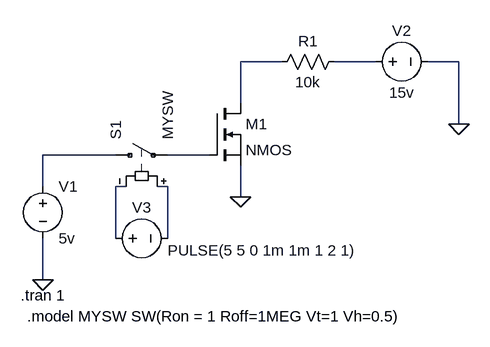
[diagram p0: schematic electronics_nmos.asc]
electronics_nmos.asc, the LTspice schematic file:
Version 4
SHEET 1 880 680
WIRE 272 48 208 48
WIRE 416 48 352 48
WIRE 544 48 496 48
WIRE 208 112 208 48
WIRE 544 144 544 48
WIRE 16 192 -96 192
WIRE 160 192 96 192
WIRE -96 240 -96 192
WIRE 32 240 16 240
WIRE 96 240 80 240
WIRE 208 256 208 208
WIRE 16 320 16 240
WIRE 96 320 96 240
WIRE -96 384 -96 320
FLAG -96 384 0
FLAG 544 144 0
FLAG 208 256 0
SYMBOL nmos 160 112 R0
SYMATTR InstName M1
SYMBOL sw 0 192 R270
SYMATTR InstName S1
SYMATTR Value MYSW
SYMBOL voltage -96 224 R0
WINDOW 123 0 0 Left 0
WINDOW 39 0 0 Left 0
SYMATTR InstName V1
SYMATTR Value 5v
SYMBOL res 368 32 R90
WINDOW 0 0 56 VBottom 2
WINDOW 3 32 56 VTop 2
SYMATTR InstName R1
SYMATTR Value 10k
SYMBOL voltage 400 48 R270
WINDOW 0 32 56 VTop 2
WINDOW 3 -32 56 VBottom 2
WINDOW 123 0 0 Left 0
WINDOW 39 0 0 Left 0
SYMATTR InstName V2
SYMATTR Value 15v
SYMBOL voltage 0 320 R270
WINDOW 0 32 56 VTop 2
WINDOW 3 -3 241 VBottom 2
WINDOW 123 0 0 Left 0
WINDOW 39 0 0 Left 0
SYMATTR InstName V3
SYMATTR Value PULSE(5 5 0 1m 1m 1 2 1)
TEXT -130 408 Left 2 !.tran 1
TEXT -120 440 Left 2 !.model MYSW SW(Ron = 1 Roff=1MEG Vt=1 Vh=0.5)

The netlist it stands for:
* electronics_nmos.asc
M1 N001 N004 0 0 NMOS
S1 N003 N004 N006 N005 MYSW
V1 N003 0 5v
R1 N002 N001 10k
V2 N002 0 15v
V3 N005 N006 PULSE(5 5 0 1m 1m 1 2 1)
.model NMOS NMOS
.model PMOS PMOS
.lib standard.mos
.tran 1
.model MYSW SW(Ron = 1 Roff=1MEG Vt=1 Vh=0.5)
.backanno
.end